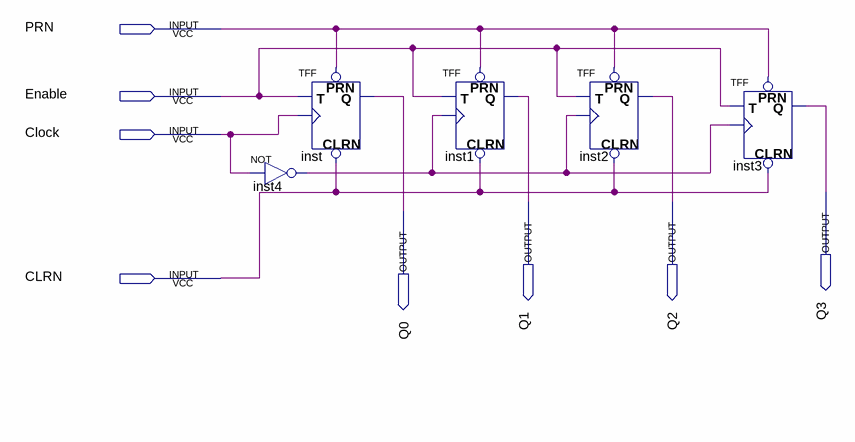
[diagram p0: schematic sheet]
// Quartus schematic lab10step3a.bdf as structural Verilog: 5 symbols, 8 pins
module lab10step3a (
  input  PRN,
  input  Enable,
  input  Clock,
  input  CLRN,
  output Q3,
  output Q1,
  output Q2,
  output Q0
);

  wire inst4_out;

  not inst4 (inst4_out, Clock);
  TFF inst (.PRN(PRN), .CLRN(CLRN), .T(Enable), .CLK(Clock), .Q(Q0));
  TFF inst1 (.PRN(PRN), .CLRN(CLRN), .T(Enable), .CLK(inst4_out), .Q(Q1));
  TFF inst2 (.PRN(PRN), .CLRN(CLRN), .T(Enable), .CLK(inst4_out), .Q(Q2));
  TFF inst3 (.PRN(PRN), .CLRN(CLRN), .T(Enable), .CLK(inst4_out), .Q(Q3));
endmodule
